# Altium schematic sheet Navigator_Connectors.SchDoc
size A; DocumentNumber: 3; SheetNumber: 3; SheetTotal: 8; PageSetup: Record=PageOptions|CenterHorizontal=True|CenterVertical=True|PrintScale=1.12|XCorrection=1.00|YCorrection=1.00|PrintKind=0|BorderSize=5000000|LeftOffset=0|BottomOffset=0|Orientation=2|PaperLength=1000|PaperWidth=1000|Scale=100|PaperSource=7|PrintQuality=-4|MediaType=1|DitherType=10|PaperKind=Letter|PrintScaleMode=1
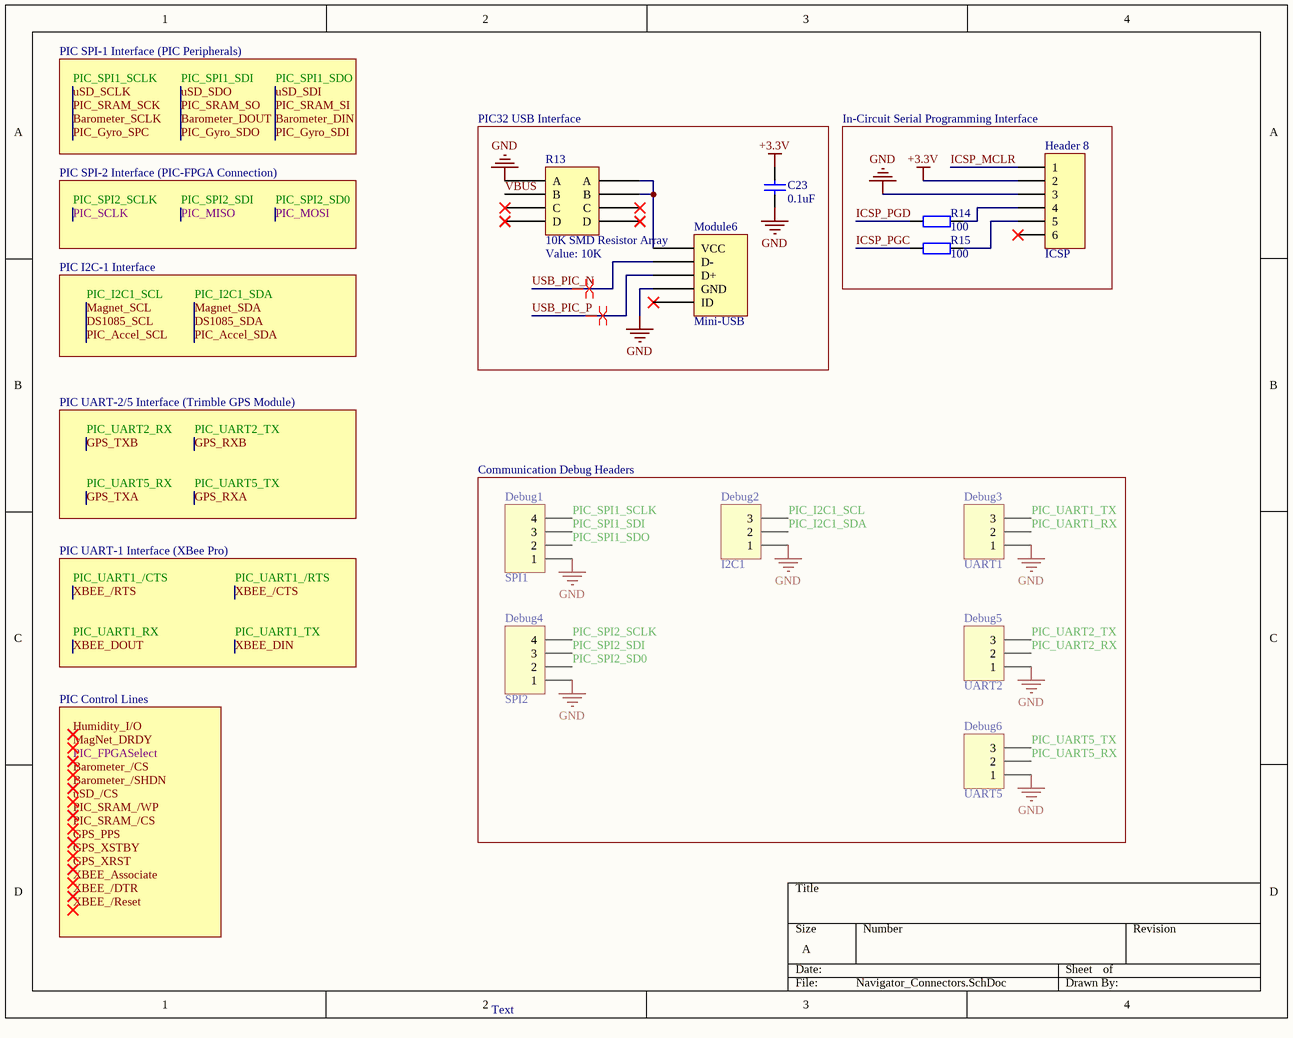
[diagram p0: Navigator_Connectors.SchDoc]

## Parts
C23  value 0.1uF  [SMD 1206]  (hidden comment: 0.1uF SMD 1206)
Debug1  SPI1  [HDR1X4]
Debug2  I2C1  [HDR1X3]
Debug3  UART1  [HDR1X3]
Debug4  SPI2  [HDR1X4]
Debug5  UART2  [HDR1X3]
Debug6  UART5  [HDR1X3]
Header_8  ICSP  [HDR1X6H]
Module6  Mini-USB  [Mini B USB Connector]
R13  10K SMD Resistor Array  value 10K  [Resistor Array YC164]
R14  value 100  [SMD 0805]  (hidden comment: 100 SMD 0805)
R15  value 100  [SMD 0805]  (hidden comment: 100 SMD 0805)

## Blocks framed on the sheet
PIC32 USB Interface: C23 Module6 R13
In-Circuit Serial Programming Interface: Header_8 R14 R15
Communication Debug Headers: Debug1-Debug6

## Nets
+3.3V: C23.2 Header_8.2
GND: C23.1 Debug1.1 Debug2.1 Debug3.1 Debug4.1 Debug5.1 Debug6.1 Header_8.3 Module6.0(GND) R13.5(A)
Barometer_DIN: Debug1.2  [also labelled PIC_Gyro_SDI, PIC_SPI1_SDO, PIC_SRAM_SI, uSD_SDI]
Barometer_DOUT: Debug1.3  [also labelled PIC_Gyro_SDO, PIC_SPI1_SDI, PIC_SRAM_SO, uSD_SDO]
Barometer_SCLK: Debug1.4  [also labelled PIC_Gyro_SPC, PIC_SPI1_SCLK, PIC_SRAM_SCK, uSD_SCLK]
DS1085_SCL: Debug2.3  [also labelled Magnet_SCL, PIC_Accel_SCL, PIC_I2C1_SCL]
DS1085_SDA: Debug2.2  [also labelled Magnet_SDA, PIC_Accel_SDA, PIC_I2C1_SDA]
GPS_RXA: Debug6.3  [also labelled PIC_UART5_TX]
GPS_RXB: Debug5.3  [also labelled PIC_UART2_TX]
GPS_TXA: Debug6.2  [also labelled PIC_UART5_RX]
GPS_TXB: Debug5.2  [also labelled PIC_UART2_RX]
ICSP_MCLR: Header_8.1
ICSP_PGC: R15.2
ICSP_PGD: R14.2
PIC_MISO: Debug4.3  [also labelled PIC_SPI2_SDI]
PIC_MOSI: Debug4.2  [also labelled PIC_SPI2_SD0]
PIC_SCLK: Debug4.4  [also labelled PIC_SPI2_SCLK]
PIC_UART1_RX: Debug3.2  [also labelled XBEE_DOUT]
PIC_UART1_TX: Debug3.3  [also labelled XBEE_DIN]
USB_PIC_N: Module6.3(D-)
USB_PIC_P: Module6.2(D+)
VBUS: R13.6(B)
NetHeader_8_4: Header_8.4 R14.1
NetHeader_8_5: Header_8.5 R15.1
NetModule6_4: Module6.4(VCC) R13.1(A) R13.2(B)

Not connected (* = marked no-connect by the designer): Header_8 6*; Module6 1(ID)*; R13 3(C)* 4(D)* 7(C)* 8(D)*

## Layout directives
differential pair: USB_PIC_N, USB_PIC_P

## Notes on the sheet
- PIC SPI-1 Interface (PIC Peripherals)
- PIC SPI-2 Interface (PIC-FPGA Connection)
- PIC I2C-1 Interface
- PIC UART-2/5 Interface (Trimble GPS Module)
- PIC UART-1 Interface (XBee Pro)
- PIC Control Lines
- Text
- Labels drawn without touching a wire or pin: Barometer_/CS, Barometer_/SHDN, GPS_PPS, GPS_XRST, GPS_XSTBY, Humidity_I/O, MagNet_DRDY, PIC_FPGASelect, PIC_SRAM_/CS, PIC_SRAM_/WP, uSD_/CS, XBEE_/DTR, XBEE_/Reset, XBEE_Associate

## Library data of the parts
C23 = Cap: Capacitor
Debug1 Debug4 = Header 4: Header, 4-Pin; LatestRevisionDate: 17-Jul-2002; LatestRevisionNote: Re-released for DXP Platform.; Publisher: Altium Limited
Debug2 Debug3 Debug5 Debug6 = Header 3: Header, 3-Pin; LatestRevisionDate: 17-Jul-2002; LatestRevisionNote: Re-released for DXP Platform.; Publisher: Altium Limited
Header_8 = Header 6: Header, 6-Pin; LatestRevisionDate: 17-Jul-2002; LatestRevisionNote: Re-released for DXP Platform.; Publisher: Altium Limited
Module6 = Mini USB Connector: pin to pad: 0>1 1>2 2>3 3>4 4>5
R13 = SMD Resistor Array: 4-Count Resistor Array; pin to pad: 5>8 6>7 7>6 8>5
R14 R15 = Res2: Resistor